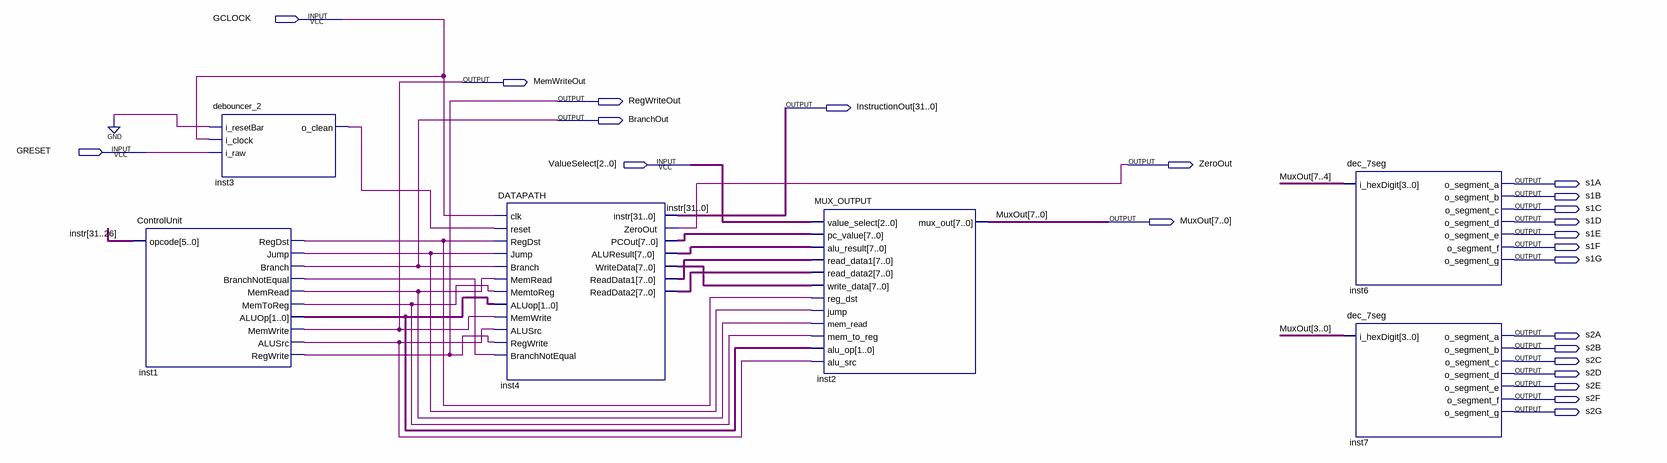
[diagram p0: schematic sheet]
// Quartus schematic SignleCycleProcessor.bdf as structural Verilog: 6 symbols, 23 pins
module SignleCycleProcessor (
  input  GCLOCK,
  input  GRESET,
  input  [2:0] ValueSelect,
  output MemWriteOut,
  output RegWriteOut,
  output [31:0] InstructionOut,
  output BranchOut,
  output ZeroOut,
  output s1A,
  output s1B,
  output s1C,
  output [7:0] MuxOut,
  output s1D,
  output s1E,
  output s1F,
  output s1G,
  output s2A,
  output s2B,
  output s2C,
  output s2D,
  output s2E,
  output s2F,
  output s2G
);

  wire inst1_alusrc, inst1_branchnotequal, inst1_jump, inst1_memread, inst1_memtoreg, inst1_regdst,
       inst3_o_clean;
  wire [1:0] inst1_aluop;
  wire [7:0] inst4_aluresult, inst4_pcout, inst4_readdata1, inst4_readdata2, inst4_writedata;

  ControlUnit inst1 (
    .opcode(InstructionOut[31:26]), .RegDst(inst1_regdst), .Jump(inst1_jump), .Branch(BranchOut),
    .BranchNotEqual(inst1_branchnotequal), .MemRead(inst1_memread), .MemToReg(inst1_memtoreg),
    .ALUOp(inst1_aluop), .MemWrite(MemWriteOut), .ALUSrc(inst1_alusrc), .RegWrite(RegWriteOut));
  debouncer_2 inst3 (.i_resetBar(1'b0), .i_clock(GCLOCK), .i_raw(GRESET), .o_clean(inst3_o_clean));
  DATAPATH inst4 (
    .clk(GCLOCK), .reset(inst3_o_clean), .RegDst(inst1_regdst), .Jump(inst1_jump), .Branch(BranchOut),
    .MemRead(inst1_memread), .MemtoReg(inst1_memtoreg), .ALUop(inst1_aluop), .MemWrite(MemWriteOut),
    .ALUSrc(inst1_alusrc), .RegWrite(RegWriteOut), .BranchNotEqual(inst1_branchnotequal),
    .instr(InstructionOut), .ZeroOut(ZeroOut), .PCOut(inst4_pcout), .ALUResult(inst4_aluresult),
    .WriteData(inst4_writedata), .ReadData1(inst4_readdata1), .ReadData2(inst4_readdata2));
  MUX_OUTPUT inst2 (
    .value_select(ValueSelect), .pc_value(inst4_pcout), .alu_result(inst4_aluresult),
    .read_data1(inst4_readdata1), .read_data2(inst4_readdata2), .write_data(inst4_writedata),
    .reg_dst(inst1_regdst), .jump(inst1_jump), .mem_read(inst1_memread), .mem_to_reg(inst1_memtoreg),
    .alu_op(inst1_aluop), .alu_src(inst1_alusrc), .mux_out(MuxOut));
  dec_7seg inst6 (
    .i_hexDigit(MuxOut[7:4]), .o_segment_a(s1A), .o_segment_b(s1B), .o_segment_c(s1C), .o_segment_d(s1D),
    .o_segment_e(s1E), .o_segment_f(s1F), .o_segment_g(s1G));
  dec_7seg inst7 (
    .i_hexDigit(MuxOut[3:0]), .o_segment_a(s2A), .o_segment_b(s2B), .o_segment_c(s2C), .o_segment_d(s2D),
    .o_segment_e(s2E), .o_segment_f(s2F), .o_segment_g(s2G));

  // Other names for the same wires on the sheet: instr[31:0] = InstructionOut
endmodule
